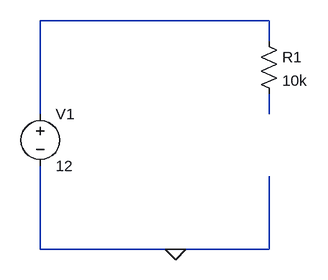
[diagram p0: schematic ex3a.asc]
ex3a.asc, the LTspice schematic file:
Version 4
SHEET 1 880 680
WIRE 224 -16 -128 -16
WIRE 224 16 224 -16
WIRE -128 128 -128 -16
WIRE 224 128 224 96
WIRE -128 336 -128 208
WIRE 80 336 -128 336
WIRE 224 336 224 224
WIRE 224 336 80 336
FLAG 80 336 0
SYMBOL res 208 0 R0
SYMATTR InstName R1
SYMATTR Value 10k
SYMBOL voltage -128 112 R0
WINDOW 123 0 0 Left 2
WINDOW 39 0 0 Left 2
SYMATTR InstName V1
SYMATTR Value 12

The netlist it stands for:
* ex3a.asc
R1 N001 N002 10k
V1 N001 0 12
.backanno
.end